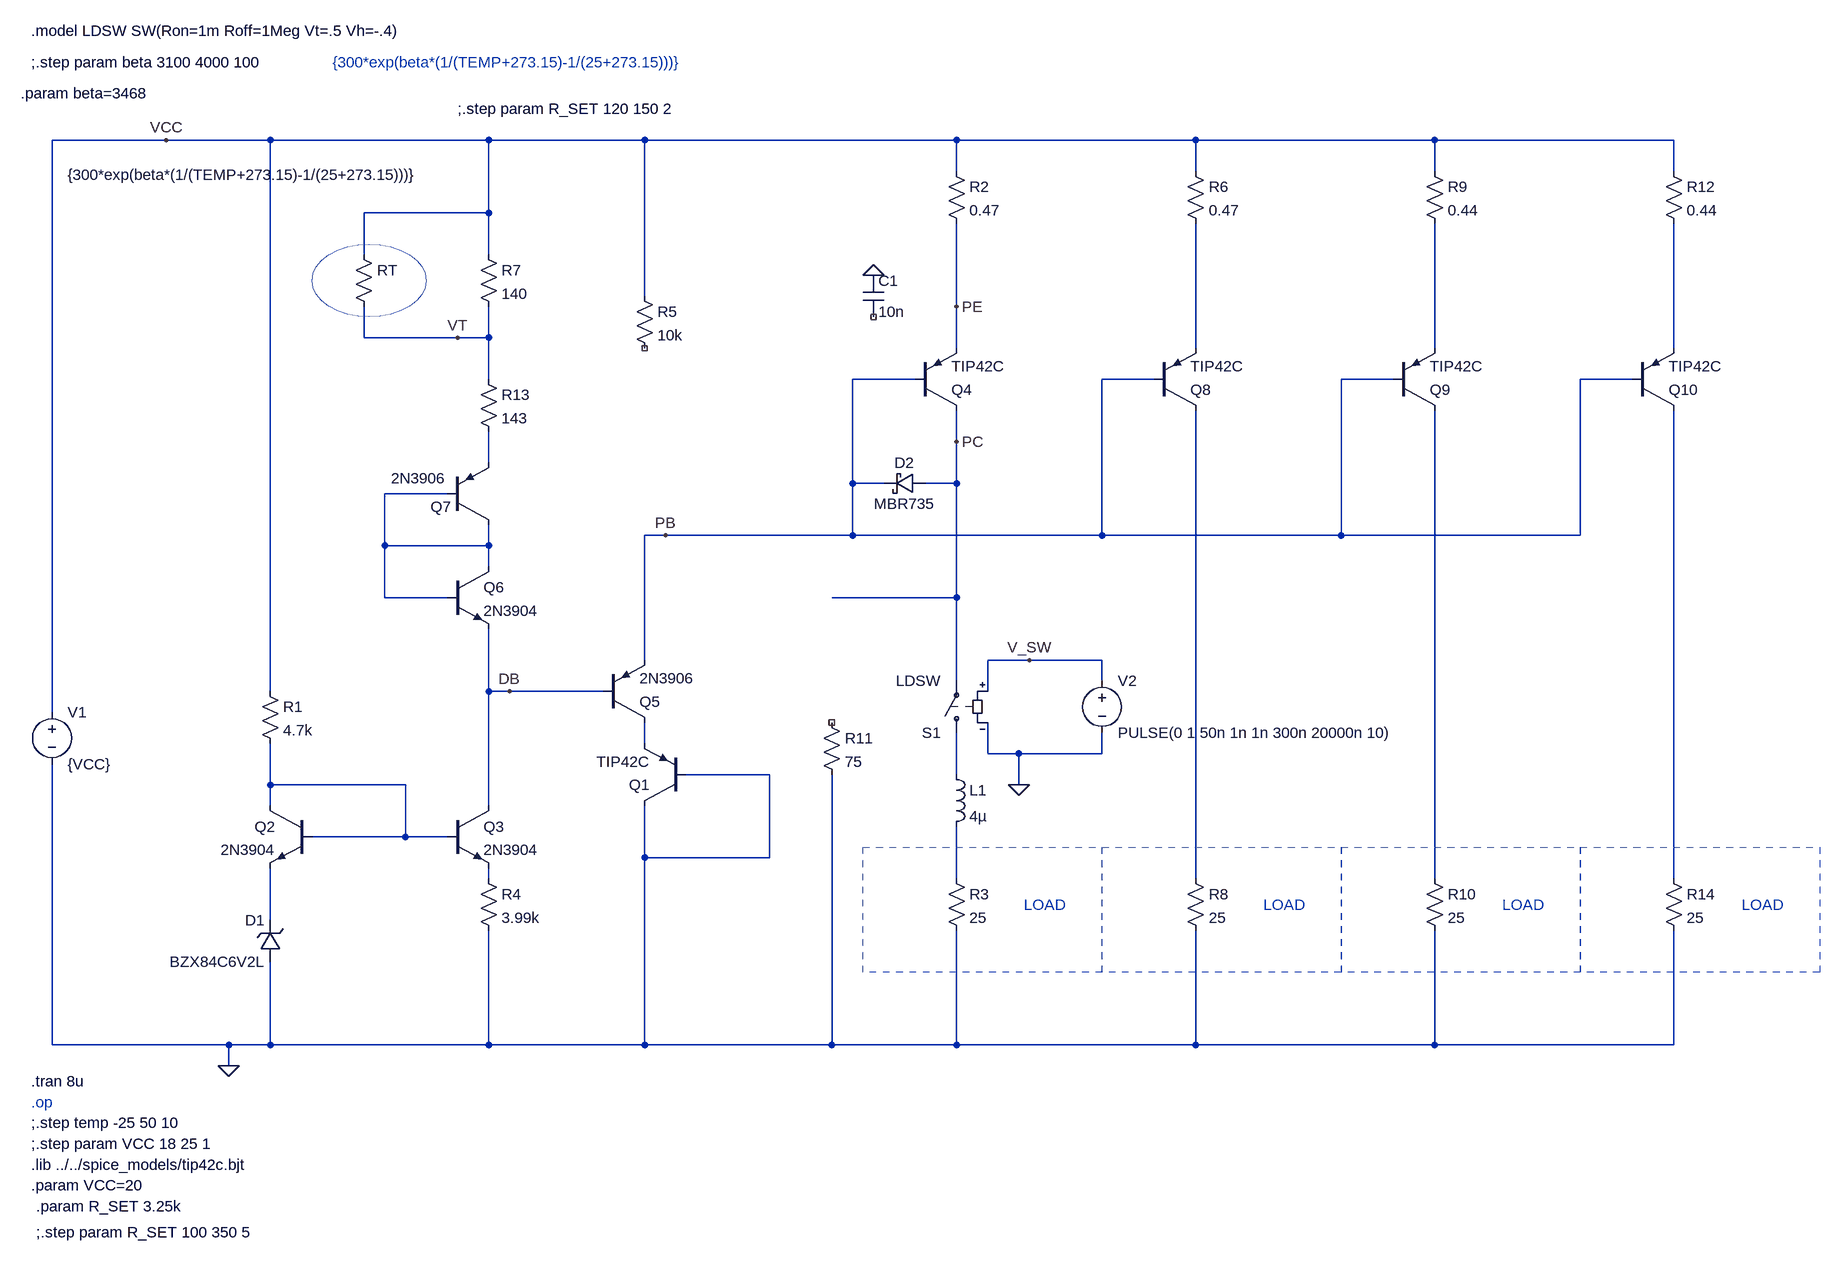
[diagram p0: schematic current_source2.asc]
current_source2.asc, the LTspice schematic file:
Version 4
SHEET 1 2020 1216
WIRE -528 -800 -704 -800
WIRE -368 -800 -528 -800
WIRE -32 -800 -368 -800
WIRE 208 -800 -32 -800
WIRE 688 -800 208 -800
WIRE 1056 -800 688 -800
WIRE 1424 -800 1056 -800
WIRE 1792 -800 1424 -800
WIRE 688 -752 688 -800
WIRE 1056 -752 1056 -800
WIRE 1424 -752 1424 -800
WIRE 1792 -752 1792 -800
WIRE -32 -688 -32 -800
WIRE -32 -688 -224 -688
WIRE -224 -624 -224 -688
WIRE -32 -624 -32 -688
WIRE 208 -560 208 -800
WIRE 688 -544 688 -672
WIRE -224 -496 -224 -544
WIRE -80 -496 -224 -496
WIRE -32 -496 -32 -544
WIRE -32 -496 -80 -496
WIRE 688 -480 688 -544
WIRE 1056 -480 1056 -672
WIRE 1424 -480 1424 -672
WIRE 1792 -480 1792 -672
WIRE -32 -432 -32 -496
WIRE 624 -432 528 -432
WIRE 992 -432 912 -432
WIRE 1360 -432 1280 -432
WIRE 1728 -432 1648 -432
WIRE 688 -336 688 -384
WIRE -32 -304 -32 -352
WIRE 528 -272 528 -432
WIRE 576 -272 528 -272
WIRE 688 -272 688 -336
WIRE 688 -272 640 -272
WIRE -96 -256 -192 -256
WIRE 240 -192 208 -192
WIRE 528 -192 528 -272
WIRE 528 -192 240 -192
WIRE 912 -192 912 -432
WIRE 912 -192 528 -192
WIRE 1280 -192 1280 -432
WIRE 1280 -192 912 -192
WIRE 1648 -192 1648 -432
WIRE 1648 -192 1280 -192
WIRE -192 -176 -192 -256
WIRE -32 -176 -32 -208
WIRE -32 -176 -192 -176
WIRE -32 -144 -32 -176
WIRE -192 -96 -192 -176
WIRE -96 -96 -192 -96
WIRE 688 -96 688 -272
WIRE 688 -96 496 -96
WIRE 208 0 208 -192
WIRE 800 0 736 0
WIRE 912 0 800 0
WIRE 688 32 688 -96
WIRE 912 32 912 0
WIRE -368 48 -368 -800
WIRE -32 48 -32 -48
WIRE 0 48 -32 48
WIRE 144 48 0 48
WIRE 736 48 736 0
WIRE -704 80 -704 -800
WIRE 208 128 208 96
WIRE 736 144 736 96
WIRE 784 144 736 144
WIRE 912 144 912 112
WIRE 912 144 784 144
WIRE 400 176 272 176
WIRE 688 176 688 112
WIRE -368 192 -368 128
WIRE -160 192 -368 192
WIRE 784 192 784 144
WIRE -368 224 -368 192
WIRE -32 224 -32 48
WIRE -160 272 -160 192
WIRE -160 272 -304 272
WIRE -96 272 -160 272
WIRE 208 304 208 224
WIRE 400 304 400 176
WIRE 400 304 208 304
WIRE -32 336 -32 320
WIRE 688 336 688 256
WIRE 1056 336 1056 -384
WIRE 1424 336 1424 -384
WIRE 1792 336 1792 -384
WIRE -368 400 -368 320
WIRE -704 592 -704 160
WIRE -432 592 -704 592
WIRE -368 592 -368 464
WIRE -368 592 -432 592
WIRE -32 592 -32 416
WIRE -32 592 -368 592
WIRE 208 592 208 304
WIRE 208 592 -32 592
WIRE 496 592 496 176
WIRE 496 592 208 592
WIRE 688 592 688 416
WIRE 688 592 496 592
WIRE 1056 592 1056 416
WIRE 1056 592 688 592
WIRE 1424 592 1424 416
WIRE 1424 592 1056 592
WIRE 1792 592 1792 416
WIRE 1792 592 1424 592
WIRE -432 624 -432 592
FLAG -432 624 0
FLAG 688 -544 PE
FLAG 688 -336 PC
FLAG -80 -496 VT
FLAG -528 -800 VCC
FLAG 240 -192 PB
FLAG 0 48 DB
FLAG 784 192 0
FLAG 800 0 V_SW
FLAG 560 -592 0
SYMBOL npn -304 224 M0
SYMATTR InstName Q2
SYMATTR Value 2N3904
SYMBOL zener -352 464 R180
WINDOW 0 24 64 Left 2
WINDOW 3 24 0 Left 2
SYMATTR InstName D1
SYMATTR Value BZX84C6V2L
SYMBOL res -384 32 R0
SYMATTR InstName R1
SYMATTR Value 4.7k
SYMBOL res 672 -768 R0
SYMATTR InstName R2
SYMATTR Value 0.47
SYMBOL res 672 320 R0
SYMATTR InstName R3
SYMATTR Value 25
SYMBOL voltage -704 64 R0
SYMATTR InstName V1
SYMATTR Value {VCC}
SYMBOL npn -96 224 R0
SYMATTR InstName Q3
SYMATTR Value 2N3904
SYMBOL res -48 320 R0
SYMATTR InstName R4
SYMATTR Value 3.99k
SYMBOL pnp 624 -384 M180
SYMATTR InstName Q4
SYMATTR Value TIP42C
SYMBOL pnp 144 96 M180
SYMATTR InstName Q5
SYMATTR Value 2N3906
SYMBOL pnp -96 -208 M180
WINDOW 0 -25 28 Left 2
WINDOW 3 -86 72 Left 2
SYMATTR InstName Q7
SYMATTR Value 2N3906
SYMBOL res 1040 -768 R0
SYMATTR InstName R6
SYMATTR Value 0.47
SYMBOL res 1040 320 R0
SYMATTR InstName R8
SYMATTR Value 25
SYMBOL pnp 992 -384 M180
SYMATTR InstName Q8
SYMATTR Value TIP42C
SYMBOL res 1408 -768 R0
SYMATTR InstName R9
SYMATTR Value 0.44
SYMBOL res 1408 320 R0
SYMATTR InstName R10
SYMATTR Value 25
SYMBOL pnp 1360 -384 M180
SYMATTR InstName Q9
SYMATTR Value TIP42C
SYMBOL npn -96 -144 R0
SYMATTR InstName Q6
SYMATTR Value 2N3904
SYMBOL res -48 -640 R0
SYMATTR InstName R7
SYMATTR Value 140
SYMBOL res -48 -448 R0
SYMATTR InstName R13
SYMATTR Value 143
SYMBOL res -240 -640 R0
WINDOW 3 -440 -107 Left 2
SYMATTR Value {300*exp(beta*(1/(TEMP+273.15)-1/(25+273.15)))}
SYMATTR InstName RT
SYMBOL res 1776 -768 R0
SYMATTR InstName R12
SYMATTR Value 0.44
SYMBOL res 1776 320 R0
SYMATTR InstName R14
SYMATTR Value 25
SYMBOL pnp 1728 -384 M180
SYMATTR InstName Q10
SYMATTR Value TIP42C
SYMBOL pnp 272 224 R180
SYMATTR InstName Q1
SYMATTR Value TIP42C
SYMBOL sw 688 128 R180
SYMATTR InstName S1
SYMATTR Value LDSW
SYMBOL voltage 912 16 R0
WINDOW 123 0 0 Left 0
WINDOW 39 0 0 Left 0
SYMATTR InstName V2
SYMATTR Value PULSE(0 1 50n 1n 1n 300n 20000n 10)
SYMBOL cap 544 -592 R0
SYMATTR InstName C1
SYMATTR Value 10n
SYMBOL res 192 -576 R0
SYMATTR InstName R5
SYMATTR Value 10k
SYMBOL res 480 80 R0
SYMATTR InstName R11
SYMATTR Value 75
SYMBOL schottky 640 -288 R90
WINDOW 0 0 32 VBottom 2
WINDOW 3 32 32 VTop 2
SYMATTR InstName D2
SYMATTR Value MBR735
SYMATTR Description Diode
SYMATTR Type diode
SYMBOL ind 672 160 R0
SYMATTR InstName L1
SYMATTR Value 4µ
TEXT -736 648 Left 2 !.tran 8u
TEXT -736 712 Left 2 !;.step temp -25 50 10
TEXT 792 376 Left 2 ;LOAD
TEXT -736 680 Left 2 ;.op
TEXT -728 840 Left 2 !.param R_SET 3.25k
TEXT -736 744 Left 2 !;.step param VCC 18 25 1
TEXT -736 776 Left 2 !.lib ../../spice_models/tip42c.bjt
TEXT 1160 376 Left 2 ;LOAD
TEXT 1528 376 Left 2 ;LOAD
TEXT -736 808 Left 2 !.param VCC=20
TEXT -728 880 Left 2 !;.step param R_SET 100 350 5
TEXT -752 -872 Left 2 !.param beta=3468
TEXT -736 -920 Left 2 !;.step param beta 3100 4000 100
TEXT -272 -920 Left 2 ;{300*exp(beta*(1/(TEMP+273.15)-1/(25+273.15)))}
TEXT 1896 376 Left 2 ;LOAD
TEXT -80 -848 Left 2 !;.step param R_SET 120 150 2
TEXT -736 -968 Left 2 !.model LDSW SW(Ron=1m Roff=1Meg Vt=.5 Vh=-.4)
RECTANGLE Normal 912 480 544 288 2
RECTANGLE Normal 1280 480 912 288 2
RECTANGLE Normal 1648 480 1280 288 2
RECTANGLE Normal 2016 480 1648 288 2
CIRCLE Normal -128 -528 -304 -640 2

The netlist it stands for:
* current_source2.asc
Q2 N008 N008 N014 0 2N3904
D1 0 N014 BZX84C6V2L
R1 VCC N008 4.7k
R2 VCC PE 0.47
R3 N010 0 25
V1 VCC 0 {VCC}
Q3 DB N008 N009 0 2N3904
R4 N009 0 3.99k
Q4 PC PB PE 0 TIP42C
Q5 N006 DB PB 0 2N3906
Q7 N005 N005 N004 0 2N3906
R6 VCC N001 0.47
R8 N011 0 25
Q8 N011 PB N001 0 TIP42C
R9 VCC N002 0.44
R10 N012 0 25
Q9 N012 PB N002 0 TIP42C
Q6 N005 N005 DB 0 2N3904
R7 VCC VT 140
R13 VT N004 143
RT VCC VT {300*exp(beta*(1/(TEMP+273.15)-1/(25+273.15)))}
R12 VCC N003 0.44
R14 N013 0 25
Q10 N013 PB N003 0 TIP42C
Q1 0 0 N006 0 TIP42C
S1 N007 PC V_SW 0 LDSW
V2 V_SW 0 PULSE(0 1 50n 1n 1n 300n 20000n 10)
C1 0 NC_01 10n
R5 VCC NC_02 10k
R11 NC_03 0 75
D2 PC PB MBR735
L1 N007 N010 4µ
.model D D
.lib standard.dio
.model NPN NPN
.model PNP PNP
.lib standard.bjt
.tran 8u
;.step temp -25 50 10
* LOAD
* .op
.param R_SET 3.25k
;.step param VCC 18 25 1
.lib ../../spice_models/tip42c.bjt
* LOAD
* LOAD
.param VCC=20
;.step param R_SET 100 350 5
.param beta=3468
;.step param beta 3100 4000 100
* {300*exp(beta*(1/(TEMP+273.15)-1/(25+273.15)))}
* LOAD
;.step param R_SET 120 150 2
.model LDSW SW(Ron=1m Roff=1Meg Vt=.5 Vh=-.4)
.backanno
.end